# Altium schematic sheet Transceiver.SchDoc
size A; SheetNumber: 1; SheetTotal: 2
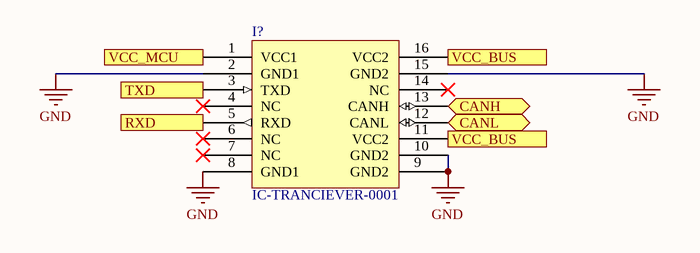
[diagram p0: Transceiver.SchDoc]

## Parts
I?  IC-TRANCIEVER-0001  [IC-TRANCIEVER-0001]

## Ports
CANH (bidir), CANL (bidir), RXD (out), TXD (in), VCC_BUS (in), VCC_MCU (in)

## Nets
GND: I?.2(GND1) I?.8(GND1) I?.9(GND2) I?.10(GND2) I?.15(GND2)
CANH: I?.13(CANH) ; port CANH
CANL: I?.12(CANL) ; port CANL
RXD: I?.5(RXD) ; port RXD
TXD: I?.3(TXD) ; port TXD
VCC_BUS: I?.11(VCC2) I?.16(VCC2) ; port VCC_BUS
VCC_MCU: I?.1(VCC1) ; port VCC_MCU

Not connected (* = marked no-connect by the designer): I? 4(NC)* 6(NC)* 7(NC)* 14(NC)*